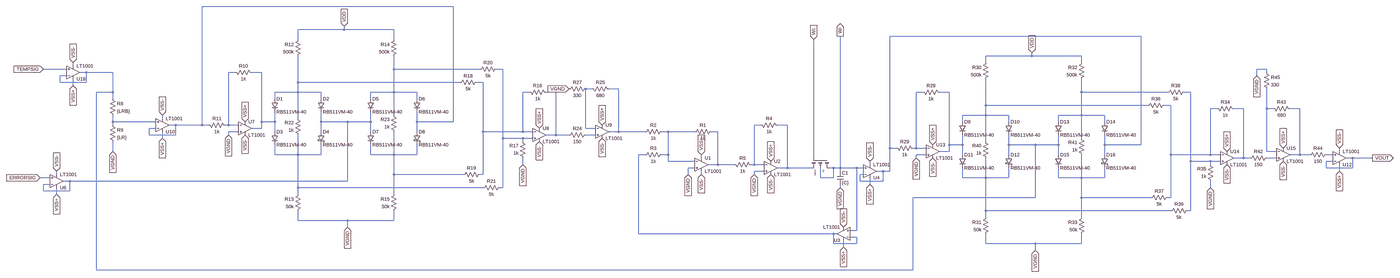
[diagram p0: schematic NEFDE.asc, whole sheet]
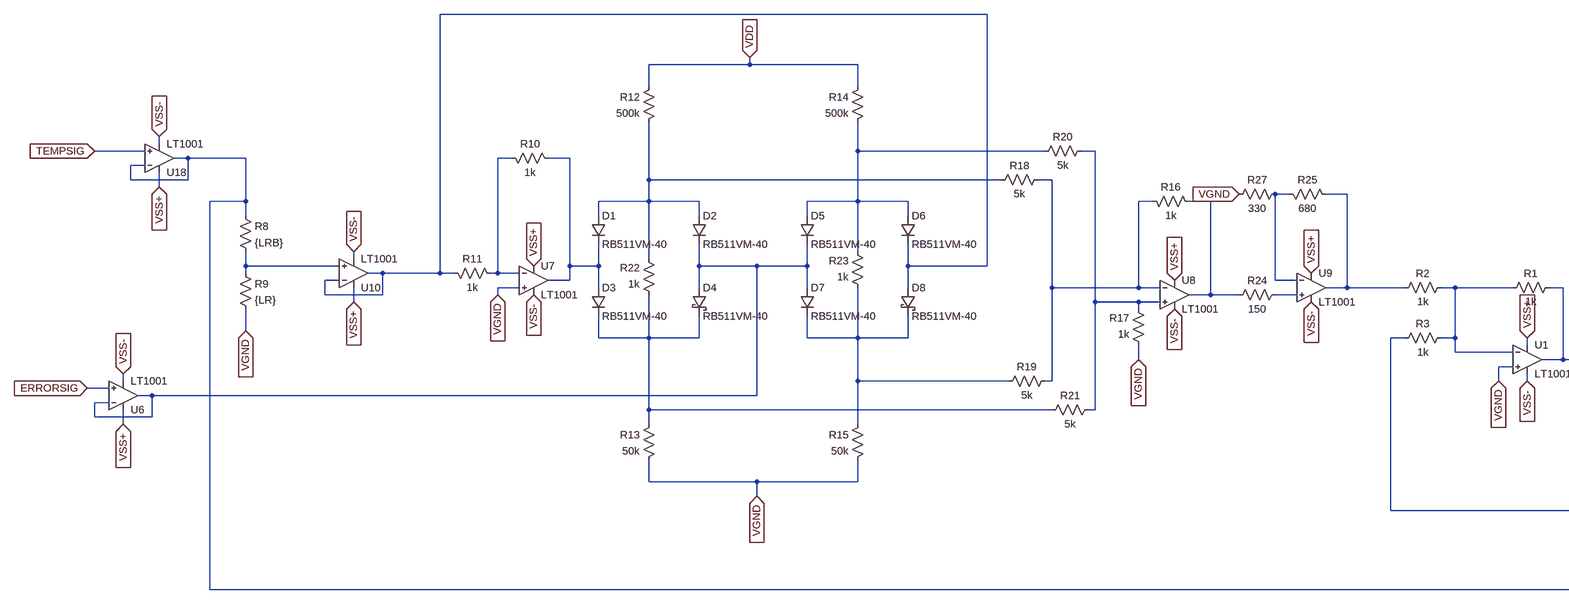
[diagram p1: schematic NEFDE.asc, part, row 1 of 1, column 1 of 2]
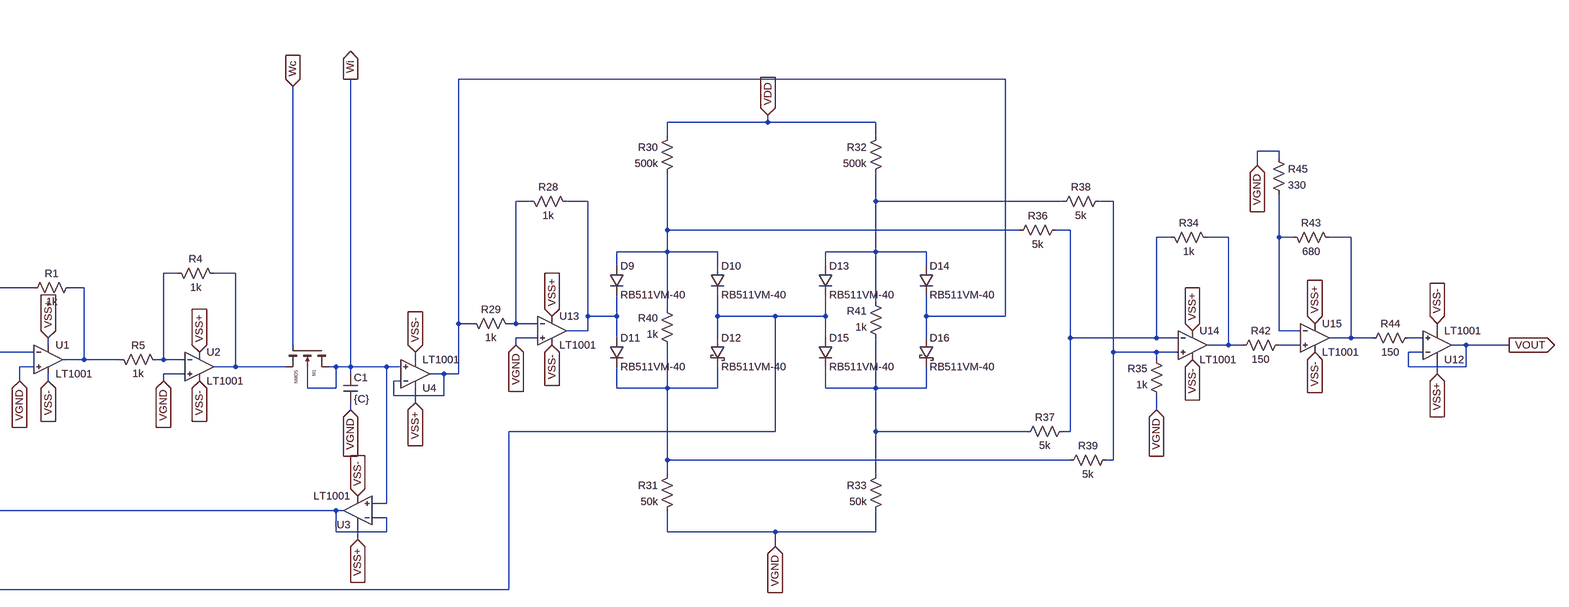
[diagram p2: schematic NEFDE.asc, part, row 1 of 1, column 2 of 2]
NEFDE.asc, the LTspice schematic file:
Version 4
SHEET 1 3916 1392
WIRE -896 -288 -2112 -288
WIRE -1424 -176 -1424 -192
WIRE -1424 -176 -1648 -176
WIRE -1184 -176 -1424 -176
WIRE 2432 -144 1216 -144
WIRE -1648 -128 -1648 -176
WIRE -1184 -128 -1184 -176
WIRE 1904 -48 1904 -64
WIRE 1904 -48 1680 -48
WIRE 2144 -48 1904 -48
WIRE 1680 -16 1680 -48
WIRE 2144 -16 2144 -48
WIRE -2736 0 -2736 -16
WIRE -2768 16 -2880 16
WIRE -1184 16 -1184 -48
WIRE -768 16 -1184 16
WIRE -656 16 -688 16
WIRE 3040 16 2992 16
WIRE -2672 32 -2704 32
WIRE -2544 32 -2672 32
WIRE -1952 32 -1984 32
WIRE -1824 32 -1872 32
WIRE 3040 32 3040 16
WIRE -2768 48 -2800 48
WIRE 2992 48 2992 16
WIRE -2800 80 -2800 48
WIRE -2672 80 -2672 32
WIRE -2672 80 -2800 80
WIRE -1648 80 -1648 -48
WIRE -864 80 -1648 80
WIRE -752 80 -784 80
WIRE -2736 96 -2736 64
WIRE -224 112 -256 112
WIRE -96 112 -144 112
WIRE -2544 128 -2544 32
WIRE -2544 128 -2624 128
WIRE -1648 128 -1648 80
WIRE -1648 128 -1760 128
WIRE -1536 128 -1648 128
WIRE -1184 128 -1184 16
WIRE -1184 128 -1296 128
WIRE -1072 128 -1184 128
WIRE -528 128 -560 128
WIRE -400 128 -448 128
WIRE 1376 128 1344 128
WIRE 1504 128 1456 128
WIRE 2144 128 2144 64
WIRE 2560 128 2144 128
WIRE 2672 128 2640 128
WIRE -2544 160 -2544 128
WIRE -1760 160 -1760 128
WIRE -1536 160 -1536 128
WIRE -1296 160 -1296 128
WIRE -1072 160 -1072 128
WIRE 1680 192 1680 64
WIRE 2464 192 1680 192
WIRE 2576 192 2544 192
WIRE 2800 208 2768 208
WIRE 2928 208 2880 208
WIRE 3040 208 3040 112
WIRE 3072 208 3040 208
WIRE 3200 208 3152 208
WIRE -1184 240 -1184 128
WIRE 1680 240 1680 192
WIRE 1680 240 1568 240
WIRE 1792 240 1680 240
WIRE 2144 240 2144 128
WIRE 2144 240 2032 240
WIRE 2256 240 2144 240
WIRE -2304 256 -2304 240
WIRE -1648 256 -1648 128
WIRE -2544 272 -2544 240
WIRE -2336 272 -2544 272
WIRE -1824 272 -1824 32
WIRE -1760 272 -1760 224
WIRE -1760 272 -1824 272
WIRE -1536 272 -1536 224
WIRE -1408 272 -1536 272
WIRE -1296 272 -1296 224
WIRE -1296 272 -1408 272
WIRE -1072 272 -1072 224
WIRE -896 272 -896 -288
WIRE -896 272 -1072 272
WIRE 1568 272 1568 240
WIRE 1792 272 1792 240
WIRE 2032 272 2032 240
WIRE 2256 272 2256 240
WIRE -2544 288 -2544 272
WIRE -2240 288 -2272 288
WIRE -2112 288 -2112 -288
WIRE -2112 288 -2240 288
WIRE -2080 288 -2112 288
WIRE -1984 288 -1984 32
WIRE -1984 288 -2000 288
WIRE -1936 288 -1984 288
WIRE 592 288 560 288
WIRE 720 288 672 288
WIRE -2336 304 -2368 304
WIRE -1824 304 -1824 272
WIRE -1824 304 -1872 304
WIRE -256 304 -256 112
WIRE -208 304 -256 304
WIRE -1936 320 -1984 320
WIRE -1760 320 -1760 272
WIRE -1536 320 -1536 272
WIRE -1296 320 -1296 272
WIRE -1072 320 -1072 272
WIRE -752 320 -752 80
WIRE -560 320 -560 128
WIRE -560 320 -752 320
WIRE -512 320 -560 320
WIRE -96 320 -96 112
WIRE -96 320 -144 320
WIRE 32 320 -96 320
WIRE 144 320 112 320
WIRE 272 320 144 320
WIRE 384 320 352 320
WIRE -2368 336 -2368 304
WIRE -2240 336 -2240 288
WIRE -2240 336 -2368 336
WIRE -1984 336 -1984 320
WIRE -400 336 -400 128
WIRE -400 336 -448 336
WIRE -336 336 -400 336
WIRE -208 336 -256 336
WIRE -2304 352 -2304 320
WIRE -656 352 -656 16
WIRE -560 352 -656 352
WIRE -512 352 -560 352
WIRE 2144 352 2144 240
WIRE -560 368 -560 352
WIRE 1680 368 1680 240
WIRE 1504 384 1504 128
WIRE 1568 384 1568 336
WIRE 1568 384 1504 384
WIRE 1792 384 1792 336
WIRE 1920 384 1792 384
WIRE 2032 384 2032 336
WIRE 2032 384 1920 384
WIRE 2256 384 2256 336
WIRE 2432 384 2432 -144
WIRE 2432 384 2256 384
WIRE 1216 400 1216 -144
WIRE 1248 400 1216 400
WIRE 1344 400 1344 128
WIRE 1344 400 1328 400
WIRE 1392 400 1344 400
WIRE -2544 416 -2544 368
WIRE 1504 416 1504 384
WIRE 1504 416 1456 416
WIRE 3040 416 3040 208
WIRE 3088 416 3040 416
WIRE 3392 416 3392 400
WIRE -1760 432 -1760 384
WIRE -1648 432 -1648 336
WIRE -1648 432 -1760 432
WIRE -1536 432 -1536 384
WIRE -1536 432 -1648 432
WIRE -1296 432 -1296 384
WIRE -1184 432 -1184 320
WIRE -1184 432 -1296 432
WIRE -1072 432 -1072 384
WIRE -1072 432 -1184 432
WIRE 32 432 0 432
WIRE 144 432 144 320
WIRE 144 432 112 432
WIRE 1392 432 1344 432
WIRE 1568 432 1568 384
WIRE 1792 432 1792 384
WIRE 2032 432 2032 384
WIRE 2256 432 2256 384
WIRE 2576 432 2576 192
WIRE 2768 432 2768 208
WIRE 2768 432 2576 432
WIRE 2816 432 2768 432
WIRE 3200 432 3200 208
WIRE 3200 432 3152 432
WIRE 3248 432 3200 432
WIRE 3360 432 3328 432
WIRE 304 448 304 432
WIRE 848 448 848 -128
WIRE 1344 448 1344 432
WIRE 2928 448 2928 208
WIRE 2928 448 2880 448
WIRE 2960 448 2928 448
WIRE 3088 448 3040 448
WIRE 3456 448 3424 448
WIRE 3552 448 3456 448
WIRE 144 464 144 432
WIRE 272 464 144 464
WIRE 2672 464 2672 128
WIRE 2768 464 2672 464
WIRE 2816 464 2768 464
WIRE 3360 464 3328 464
WIRE -560 480 -560 448
WIRE 384 480 384 320
WIRE 384 480 336 480
WIRE 464 480 384 480
WIRE 560 480 560 288
WIRE 560 480 544 480
WIRE 608 480 560 480
WIRE 1120 480 1120 464
WIRE 2768 480 2768 464
WIRE 272 496 240 496
WIRE 720 496 720 288
WIRE 720 496 672 496
WIRE 832 496 720 496
WIRE 944 496 928 496
WIRE 976 496 976 -144
WIRE 976 496 944 496
WIRE 1056 496 976 496
WIRE 1088 496 1056 496
WIRE 3328 496 3328 464
WIRE 3456 496 3456 448
WIRE 3456 496 3328 496
WIRE 608 512 560 512
WIRE 976 512 976 496
WIRE 1184 512 1152 512
WIRE 1216 512 1216 400
WIRE 1216 512 1184 512
WIRE 3392 512 3392 480
WIRE -2816 528 -2816 512
WIRE -1184 528 -1184 432
WIRE -848 528 -1184 528
WIRE -752 528 -752 320
WIRE -752 528 -768 528
WIRE 240 528 240 496
WIRE 304 528 304 512
WIRE 560 528 560 512
WIRE 1088 528 1072 528
WIRE -2848 544 -2896 544
WIRE 880 544 880 496
WIRE 944 544 944 496
WIRE 944 544 880 544
WIRE 1568 544 1568 496
WIRE 1680 544 1680 448
WIRE 1680 544 1568 544
WIRE 1792 544 1792 496
WIRE 1792 544 1680 544
WIRE 2032 544 2032 496
WIRE 2144 544 2144 432
WIRE 2144 544 2032 544
WIRE 2256 544 2256 496
WIRE 2256 544 2144 544
WIRE -2752 560 -2784 560
WIRE -1408 560 -1408 272
WIRE -1408 560 -2752 560
WIRE 1072 560 1072 528
WIRE 1184 560 1184 512
WIRE 1184 560 1072 560
WIRE -2848 576 -2880 576
WIRE 1120 576 1120 544
WIRE -1648 592 -1648 432
WIRE -752 592 -1648 592
WIRE -656 592 -656 352
WIRE -656 592 -672 592
WIRE 976 592 976 576
WIRE 2768 592 2768 560
WIRE -2880 608 -2880 576
WIRE -2752 608 -2752 560
WIRE -2752 608 -2880 608
WIRE -2816 624 -2816 592
WIRE -1648 624 -1648 592
WIRE -1184 624 -1184 528
WIRE 1920 640 1920 384
WIRE 1920 640 1328 640
WIRE 2144 640 2144 544
WIRE 2480 640 2144 640
WIRE 2576 640 2576 432
WIRE 2576 640 2560 640
WIRE 1680 704 1680 544
WIRE 2576 704 1680 704
WIRE 2672 704 2672 464
WIRE 2672 704 2656 704
WIRE 1680 736 1680 704
WIRE 2144 736 2144 640
WIRE -1648 752 -1648 704
WIRE -1408 752 -1648 752
WIRE -1184 752 -1184 704
WIRE -1184 752 -1408 752
WIRE -1408 784 -1408 752
WIRE 1056 800 1056 496
WIRE 1056 800 1024 800
WIRE 0 816 0 432
WIRE 944 816 0 816
WIRE 960 816 944 816
WIRE 1056 832 1024 832
WIRE 944 864 944 816
WIRE 1056 864 1056 832
WIRE 1056 864 944 864
WIRE 1680 864 1680 816
WIRE 1920 864 1680 864
WIRE 2144 864 2144 816
WIRE 2144 864 1920 864
WIRE 992 880 992 848
WIRE 1920 896 1920 864
WIRE -2624 992 -2624 128
WIRE 1328 992 1328 640
WIRE 1328 992 -2624 992
FLAG -2880 16 TEMPSIG
IOPIN -2880 16 In
FLAG 3552 448 VOUT
IOPIN 3552 448 Out
FLAG -1984 336 VGND
IOPIN -1984 336 In
FLAG -1408 784 VGND
IOPIN -1408 784 In
FLAG -560 480 VGND
IOPIN -560 480 In
FLAG 240 528 VGND
IOPIN 240 528 In
FLAG 560 528 VGND
IOPIN 560 528 In
FLAG 976 592 VGND
IOPIN 976 592 In
FLAG 1344 448 VGND
IOPIN 1344 448 In
FLAG 1920 896 VGND
IOPIN 1920 896 In
FLAG 2768 592 VGND
IOPIN 2768 592 In
FLAG 2992 48 VGND
IOPIN 2992 48 In
FLAG -336 112 VGND
IOPIN -336 112 In
FLAG 1904 -64 VDD
IOPIN 1904 -64 In
FLAG -2544 416 VGND
IOPIN -2544 416 In
FLAG -2816 624 VSS+
IOPIN -2816 624 In
FLAG -2304 352 VSS+
IOPIN -2304 352 In
FLAG -1904 272 VSS+
IOPIN -1904 272 In
FLAG -480 304 VSS+
IOPIN -480 304 In
FLAG -176 288 VSS+
IOPIN -176 288 In
FLAG 304 432 VSS+
IOPIN 304 432 In
FLAG 640 464 VSS+
IOPIN 640 464 In
FLAG 1424 384 VSS+
IOPIN 1424 384 In
FLAG 2848 416 VSS+
IOPIN 2848 416 In
FLAG 3120 400 VSS+
IOPIN 3120 400 In
FLAG 3392 512 VSS+
IOPIN 3392 512 In
FLAG 992 880 VSS+
IOPIN 992 880 In
FLAG -2304 240 VSS-
IOPIN -2304 240 In
FLAG -2816 512 VSS-
IOPIN -2816 512 In
FLAG -1904 336 VSS-
IOPIN -1904 336 In
FLAG -480 368 VSS-
IOPIN -480 368 In
FLAG 304 528 VSS-
IOPIN 304 528 In
FLAG 640 528 VSS-
IOPIN 640 528 In
FLAG 1120 464 VSS-
IOPIN 1120 464 In
FLAG 2848 480 VSS-
IOPIN 2848 480 In
FLAG 3120 464 VSS-
IOPIN 3120 464 In
FLAG 3392 400 VSS-
IOPIN 3392 400 In
FLAG 1120 576 VSS+
IOPIN 1120 576 In
FLAG 992 784 VSS-
IOPIN 992 784 In
FLAG 1424 448 VSS-
IOPIN 1424 448 In
FLAG -176 352 VSS-
IOPIN -176 352 In
FLAG 848 -128 Wc
IOPIN 848 -128 In
FLAG -2896 544 ERRORSIG
IOPIN -2896 544 In
FLAG -1424 -192 VDD
IOPIN -1424 -192 In
FLAG -2736 96 VSS+
IOPIN -2736 96 In
FLAG -2736 -16 VSS-
IOPIN -2736 -16 In
FLAG 976 -144 Wi
IOPIN 976 -144 Out
SYMBOL nmos4 928 448 R90
WINDOW 0 56 32 Left 0
WINDOW 3 56 72 Left 0
SYMATTR InstName M1
SYMBOL cap 960 512 R0
SYMATTR InstName C1
SYMATTR Value {C}
SYMATTR SpiceLine IC=0
SYMBOL OpAmps\\LT1001 304 416 R0
SYMATTR InstName U1
SYMBOL res 368 304 R90
WINDOW 0 0 56 VBottom 2
WINDOW 3 32 56 VTop 2
SYMATTR InstName R1
SYMATTR Value 1k
SYMBOL res 128 304 R90
WINDOW 0 0 56 VBottom 2
WINDOW 3 32 56 VTop 2
SYMATTR InstName R2
SYMATTR Value 1k
SYMBOL res 128 416 R90
WINDOW 0 0 56 VBottom 2
WINDOW 3 32 56 VTop 2
SYMATTR InstName R3
SYMATTR Value 1k
SYMBOL OpAmps\\LT1001 640 432 R0
SYMATTR InstName U2
SYMBOL res 576 272 M90
WINDOW 0 0 56 VBottom 2
WINDOW 3 32 56 VTop 2
SYMATTR InstName R4
SYMATTR Value 1k
SYMBOL res 448 464 M90
WINDOW 0 0 56 VBottom 2
WINDOW 3 32 56 VTop 2
SYMATTR InstName R5
SYMATTR Value 1k
SYMBOL OpAmps\\LT1001 992 880 R180
SYMATTR InstName U3
SYMBOL OpAmps\\LT1001 1120 576 M180
SYMATTR InstName U4
SYMBOL res -2560 144 R0
SYMATTR InstName R8
SYMATTR Value {LRB}
SYMBOL res -2560 272 R0
SYMATTR InstName R9
SYMATTR Value {LR}
SYMBOL OpAmps\\LT1001 -2816 624 M180
SYMATTR InstName U6
SYMBOL diode -1776 160 R0
SYMATTR InstName D1
SYMATTR Value RB511VM-40
SYMBOL OpAmps\\LT1001 -1904 240 R0
SYMATTR InstName U7
SYMBOL res -1968 16 M90
WINDOW 0 0 56 VBottom 2
WINDOW 3 32 56 VTop 2
SYMATTR InstName R10
SYMATTR Value 1k
SYMBOL res -2096 272 M90
WINDOW 0 0 56 VBottom 2
WINDOW 3 32 56 VTop 2
SYMATTR InstName R11
SYMATTR Value 1k
SYMBOL diode -1552 160 R0
SYMATTR InstName D2
SYMATTR Value RB511VM-40
SYMBOL diode -1776 320 R0
SYMATTR InstName D3
SYMATTR Value RB511VM-40
SYMBOL schottky -1552 320 R0
SYMATTR InstName D4
SYMATTR Value RB511VM-40
SYMATTR Description Diode
SYMATTR Type diode
SYMBOL res -1632 -144 M0
SYMATTR InstName R12
SYMATTR Value 500k
SYMBOL res -1632 608 M0
SYMATTR InstName R13
SYMATTR Value 50k
SYMBOL diode -1312 160 R0
SYMATTR InstName D5
SYMATTR Value RB511VM-40
SYMBOL diode -1088 160 R0
SYMATTR InstName D6
SYMATTR Value RB511VM-40
SYMBOL diode -1312 320 R0
SYMATTR InstName D7
SYMATTR Value RB511VM-40
SYMBOL schottky -1088 320 R0
SYMATTR InstName D8
SYMATTR Value RB511VM-40
SYMATTR Description Diode
SYMATTR Type diode
SYMBOL res -1168 -144 M0
SYMATTR InstName R14
SYMATTR Value 500k
SYMBOL res -1168 608 M0
SYMATTR InstName R15
SYMATTR Value 50k
SYMBOL OpAmps\\LT1001 -480 272 R0
SYMATTR InstName U8
SYMBOL res -544 112 M90
WINDOW 0 0 56 VBottom 2
WINDOW 3 32 56 VTop 2
SYMATTR InstName R16
SYMATTR Value 1k
SYMBOL res -544 464 R180
WINDOW 0 36 76 Left 2
WINDOW 3 36 40 Left 2
SYMATTR InstName R17
SYMATTR Value 1k
SYMBOL res -768 64 R90
WINDOW 0 0 56 VBottom 2
WINDOW 3 32 56 VTop 2
SYMATTR InstName R18
SYMATTR Value 5k
SYMBOL res -752 512 R90
WINDOW 0 0 56 VBottom 2
WINDOW 3 32 56 VTop 2
SYMATTR InstName R19
SYMATTR Value 5k
SYMBOL res -672 0 R90
WINDOW 0 0 56 VBottom 2
WINDOW 3 32 56 VTop 2
SYMATTR InstName R20
SYMATTR Value 5k
SYMBOL res -656 576 R90
WINDOW 0 0 56 VBottom 2
WINDOW 3 32 56 VTop 2
SYMATTR InstName R21
SYMATTR Value 5k
SYMBOL res -1632 352 R180
WINDOW 0 36 76 Left 2
WINDOW 3 36 40 Left 2
SYMATTR InstName R22
SYMATTR Value 1k
SYMBOL res -1168 336 R180
WINDOW 0 36 76 Left 2
WINDOW 3 36 40 Left 2
SYMATTR InstName R23
SYMATTR Value 1k
SYMBOL res -352 352 R270
WINDOW 0 32 56 VTop 2
WINDOW 3 0 56 VBottom 2
SYMATTR InstName R24
SYMATTR Value 150
SYMBOL OpAmps\\LT1001 -176 256 R0
SYMATTR InstName U9
SYMBOL res -240 96 M90
WINDOW 0 0 56 VBottom 2
WINDOW 3 32 56 VTop 2
SYMATTR InstName R25
SYMATTR Value 680
SYMBOL res -352 128 R270
WINDOW 0 32 56 VTop 2
WINDOW 3 0 56 VBottom 2
SYMATTR InstName R27
SYMATTR Value 330
SYMBOL OpAmps\\LT1001 -2304 352 M180
SYMATTR InstName U10
SYMBOL OpAmps\\LT1001 3392 512 M180
SYMATTR InstName U12
SYMBOL diode 1552 272 R0
SYMATTR InstName D9
SYMATTR Value RB511VM-40
SYMBOL OpAmps\\LT1001 1424 352 R0
SYMATTR InstName U13
SYMBOL res 1360 112 M90
WINDOW 0 0 56 VBottom 2
WINDOW 3 32 56 VTop 2
SYMATTR InstName R28
SYMATTR Value 1k
SYMBOL res 1232 384 M90
WINDOW 0 0 56 VBottom 2
WINDOW 3 32 56 VTop 2
SYMATTR InstName R29
SYMATTR Value 1k
SYMBOL diode 1776 272 R0
SYMATTR InstName D10
SYMATTR Value RB511VM-40
SYMBOL diode 1552 432 R0
SYMATTR InstName D11
SYMATTR Value RB511VM-40
SYMBOL schottky 1776 432 R0
SYMATTR InstName D12
SYMATTR Value RB511VM-40
SYMATTR Description Diode
SYMATTR Type diode
SYMBOL res 1696 -32 M0
SYMATTR InstName R30
SYMATTR Value 500k
SYMBOL res 1696 720 M0
SYMATTR InstName R31
SYMATTR Value 50k
SYMBOL diode 2016 272 R0
SYMATTR InstName D13
SYMATTR Value RB511VM-40
SYMBOL diode 2240 272 R0
SYMATTR InstName D14
SYMATTR Value RB511VM-40
SYMBOL diode 2016 432 R0
SYMATTR InstName D15
SYMATTR Value RB511VM-40
SYMBOL schottky 2240 432 R0
SYMATTR InstName D16
SYMATTR Value RB511VM-40
SYMATTR Description Diode
SYMATTR Type diode
SYMBOL res 2160 -32 M0
SYMATTR InstName R32
SYMATTR Value 500k
SYMBOL res 2160 720 M0
SYMATTR InstName R33
SYMATTR Value 50k
SYMBOL OpAmps\\LT1001 2848 384 R0
SYMATTR InstName U14
SYMBOL res 2784 192 M90
WINDOW 0 0 56 VBottom 2
WINDOW 3 32 56 VTop 2
SYMATTR InstName R34
SYMATTR Value 1k
SYMBOL res 2784 576 R180
WINDOW 0 36 76 Left 2
WINDOW 3 36 40 Left 2
SYMATTR InstName R35
SYMATTR Value 1k
SYMBOL res 2560 176 R90
WINDOW 0 0 56 VBottom 2
WINDOW 3 32 56 VTop 2
SYMATTR InstName R36
SYMATTR Value 5k
SYMBOL res 2576 624 R90
WINDOW 0 0 56 VBottom 2
WINDOW 3 32 56 VTop 2
SYMATTR InstName R37
SYMATTR Value 5k
SYMBOL res 2656 112 R90
WINDOW 0 0 56 VBottom 2
WINDOW 3 32 56 VTop 2
SYMATTR InstName R38
SYMATTR Value 5k
SYMBOL res 2672 688 R90
WINDOW 0 0 56 VBottom 2
WINDOW 3 32 56 VTop 2
SYMATTR InstName R39
SYMATTR Value 5k
SYMBOL res 1696 464 R180
WINDOW 0 36 76 Left 2
WINDOW 3 36 40 Left 2
SYMATTR InstName R40
SYMATTR Value 1k
SYMBOL res 2160 448 R180
WINDOW 0 36 76 Left 2
WINDOW 3 36 40 Left 2
SYMATTR InstName R41
SYMATTR Value 1k
SYMBOL res 2944 464 R270
WINDOW 0 32 56 VTop 2
WINDOW 3 0 56 VBottom 2
SYMATTR InstName R42
SYMATTR Value 150
SYMBOL OpAmps\\LT1001 3120 368 R0
SYMATTR InstName U15
SYMBOL res 3056 192 M90
WINDOW 0 0 56 VBottom 2
WINDOW 3 32 56 VTop 2
SYMATTR InstName R43
SYMATTR Value 680
SYMBOL res 3232 448 R270
WINDOW 0 32 56 VTop 2
WINDOW 3 0 56 VBottom 2
SYMATTR InstName R44
SYMATTR Value 150
SYMBOL res 3024 16 R0
SYMATTR InstName R45
SYMATTR Value 330
SYMBOL OpAmps\\LT1001 -2736 96 M180
SYMATTR InstName U18

The netlist it stands for:
* NEFDE.asc
M1 Wi Wc N025 Wi NMOS
C1 Wi VGND {C} IC=0
XU1 VGND N026 VSS+ VSS- N027 LT1001  ; pins In+ In- V+ V- OUT
R1 N027 N026 1k
R2 N026 N011 1k
R3 N026 N031 1k
XU2 VGND N024 VSS+ VSS- N025 LT1001  ; pins In+ In- V+ V- OUT
R4 N024 N025 1k
R5 N027 N024 1k
XU3 Wi N031 VSS+ VSS- N031 LT1001  ; pins In+ In- V+ V- OUT
XU4 Wi N002 VSS+ VSS- N002 LT1001  ; pins In+ In- V+ V- OUT
R8 N005 N022 {LRB}
R9 N022 VGND {LR}
XU6 ERRORSIG N023 VSS+ VSS- N023 LT1001  ; pins In+ In- V+ V- OUT
D1 N008 N007 RB511VM-40
XU7 VGND N006 VSS+ VSS- N007 LT1001  ; pins In+ In- V+ V- OUT
R10 N006 N007 1k
R11 N001 N006 1k
D2 N008 N023 RB511VM-40
D3 N007 N029 RB511VM-40
D4 N023 N029 RB511VM-40
R12 VDD N008 500k
R13 N029 VGND 50k
D5 N003 N023 RB511VM-40
D6 N003 N001 RB511VM-40
D7 N023 N030 RB511VM-40
D8 N001 N030 RB511VM-40
R14 VDD N003 500k
R15 N030 VGND 50k
XU8 N004 N009 VSS+ VSS- N012 LT1001  ; pins In+ In- V+ V- OUT
R16 N009 N012 1k
R17 VGND N004 1k
R18 N009 N008 5k
R19 N009 N030 5k
R20 N004 N003 5k
R21 N004 N029 5k
R22 N029 N008 1k
R23 N030 N003 1k
R24 N012 N028 150
XU9 N028 N010 VSS+ VSS- N011 LT1001  ; pins In+ In- V+ V- OUT
R25 N010 N011 680
R27 VGND N010 330
XU10 N022 N001 VSS+ VSS- N001 LT1001  ; pins In+ In- V+ V- OUT
XU12 N032 VOUT VSS+ VSS- VOUT LT1001  ; pins In+ In- V+ V- OUT
D9 N017 N014 RB511VM-40
XU13 VGND N013 VSS+ VSS- N014 LT1001  ; pins In+ In- V+ V- OUT
R28 N013 N014 1k
R29 N002 N013 1k
D10 N017 N005 RB511VM-40
D11 N014 N034 RB511VM-40
D12 N005 N034 RB511VM-40
R30 VDD N017 500k
R31 N034 VGND 50k
D13 N015 N005 RB511VM-40
D14 N015 N002 RB511VM-40
D15 N005 N035 RB511VM-40
D16 N002 N035 RB511VM-40
R32 VDD N015 500k
R33 N035 VGND 50k
XU14 N016 N018 VSS+ VSS- N019 LT1001  ; pins In+ In- V+ V- OUT
R34 N018 N019 1k
R35 VGND N016 1k
R36 N018 N017 5k
R37 N018 N035 5k
R38 N016 N015 5k
R39 N016 N034 5k
R40 N034 N017 1k
R41 N035 N015 1k
R42 N019 N033 150
XU15 N033 N020 VSS+ VSS- N021 LT1001  ; pins In+ In- V+ V- OUT
R43 N020 N021 680
R44 N021 N032 150
R45 VGND N020 330
XU18 TEMPSIG N005 VSS+ VSS- N005 LT1001  ; pins In+ In- V+ V- OUT
.model D D
.lib standard.dio
.model NMOS NMOS
.model PMOS PMOS
.lib standard.mos
.lib LTC.lib
.backanno
.end